# EAGLE design DCDC-BASE-X2B (EAGLE 9.6.2)
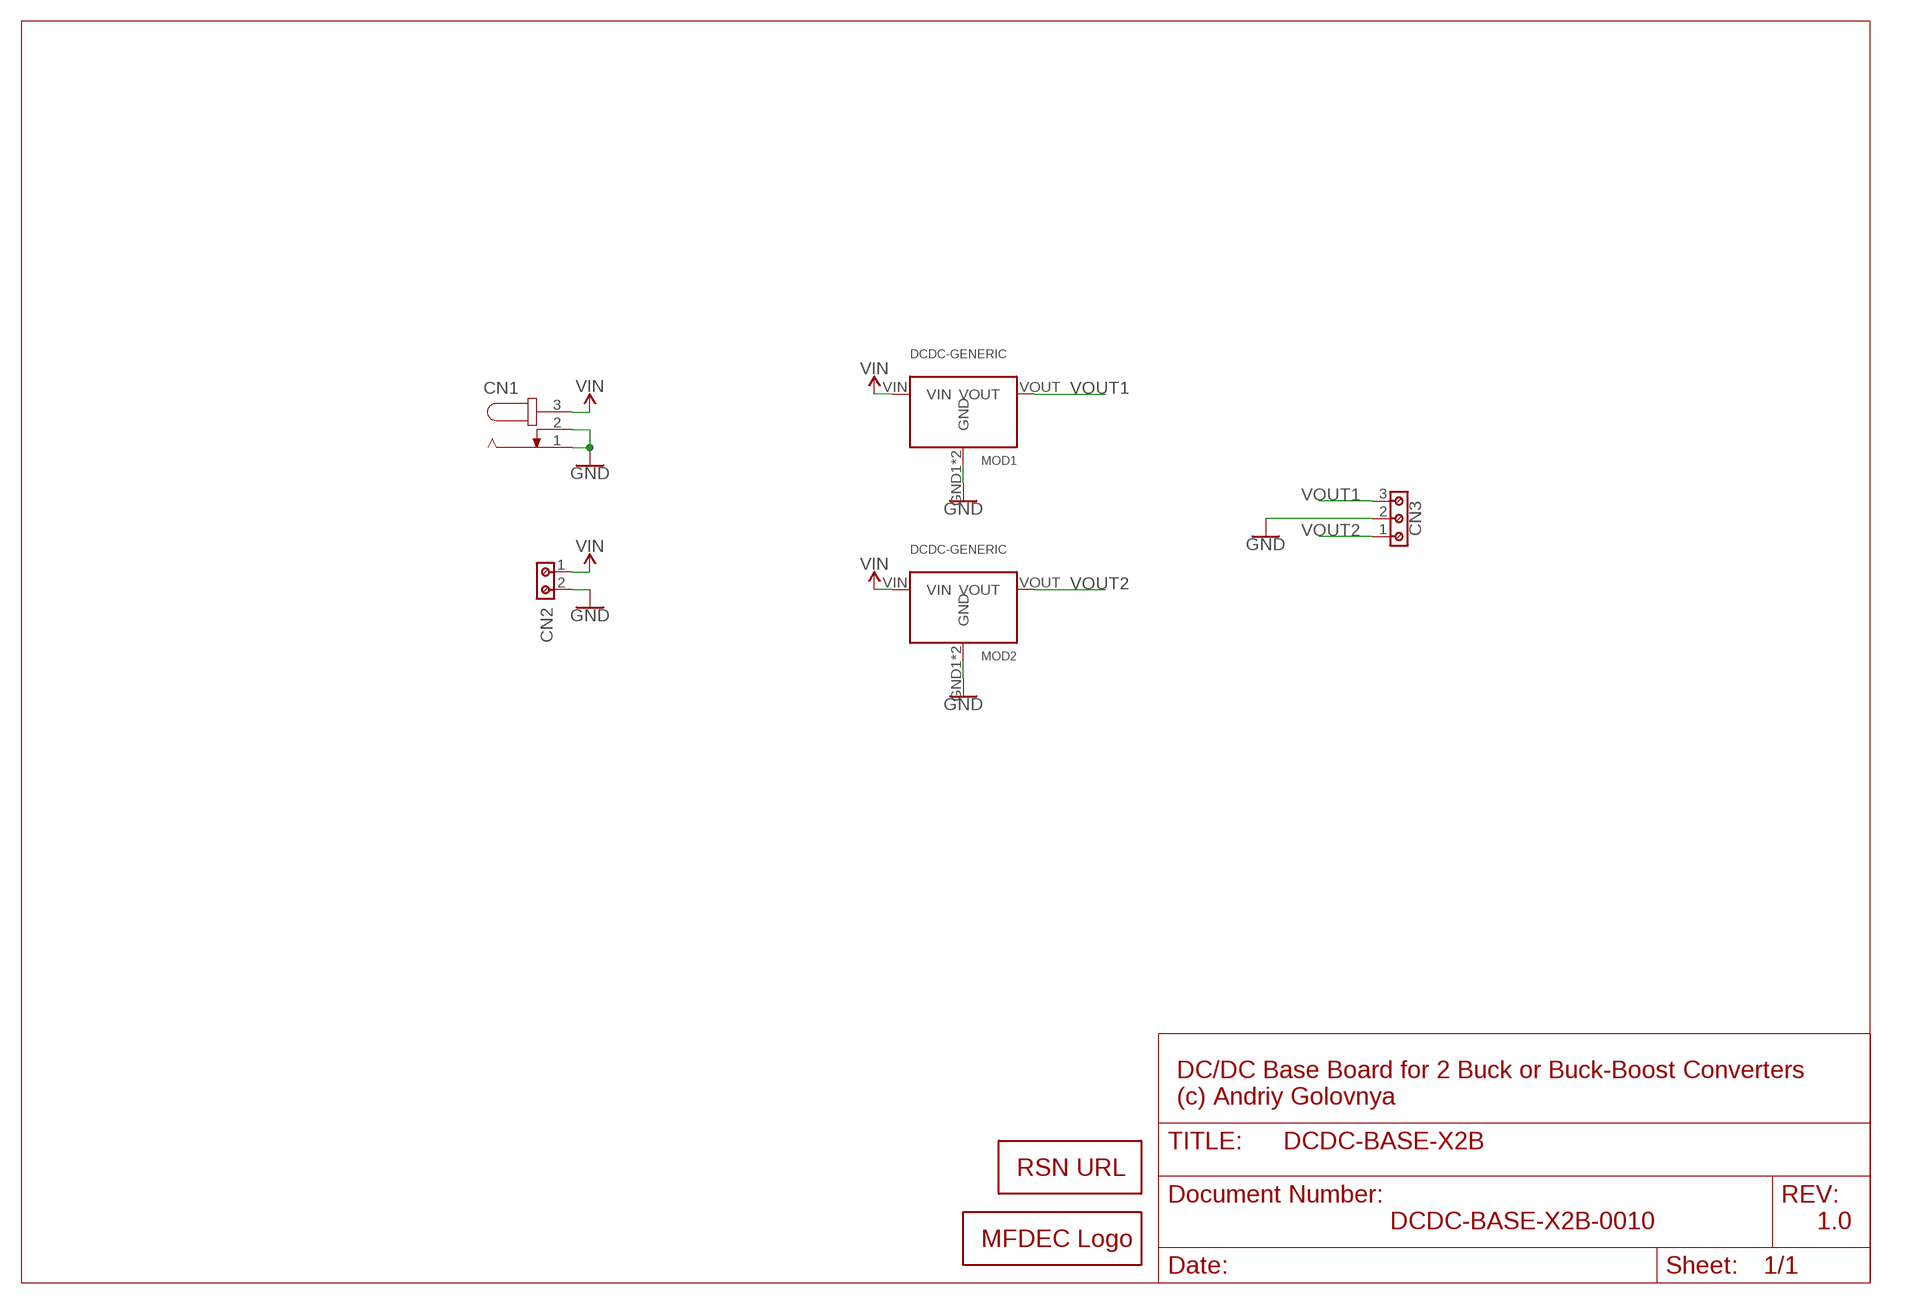
[diagram p0: schematic, sheet 1]

## Parts
CN1  JACK-PLUG1  [SPC4078]
CN2  691213510002  [691213510002]
CN3  691213510003  [691213510003]
LOGO1  RSNURL_QR_8MM  [RSNURL_QR_8MM]
LOGO2  MFDECLOGO_L_10MM  [MFDEC_L_10MM]
MOD1  DCDC-GENERIC  [DCDC-BOARD]
MOD2  DCDC-GENERIC  [DCDC-BOARD]

## Nets
GND: CN1.1 CN1.2 CN2.2 CN3.2 MOD1.GND1(GND) MOD1.GND2(GND) MOD2.GND1(GND) MOD2.GND2(GND)
VIN: CN1.3 CN2.1 MOD1.VIN MOD2.VIN
VOUT1: CN3.3 MOD1.VOUT
VOUT2: CN3.1 MOD2.VOUT

## Notes on the sheet
- DC/DC Base Board for 2 Buck or Buck-Boost Converters
  (c) Andriy Golovnya
- DCDC-BASE-X2B-0010 | 1.0

## Library data of the parts
CN1 = con-jack:JACK-PLUG: DC POWER JACK Power Jack, DC, Right Angle, Through Hole, Rated 5A at 16VDC, PC Terminals Distributor: Farnell (www.Farnell.de) Drawing: 84N1161.pdf / 84N1162.pdf Manufacturer: SPC Technology (www.spctechnology.com) Type: SPC4077 / SPC 4078; OC_FARNELL: unknown; OC_NEWARK: unknown
CN2 = Wurth_Connectors_WR-TBL Rising Cage Clamp:691213510002: WR-TBL Serie 2135 - 5.08 mm Horizontal Entry Modular w. Rising Cage Clamp KIND PROPERTIES Pitch 5.08 mm MATERIAL PROPERTIES Insulator Material PA66 Insulator Flammability Rating UL94 V-0 Contact Material Copper Alloy Contact Plating Tin over Nickel Contact Type Stamped Terminal Screw Material Steel Terminal Screw Plating Zinc Wire Guard Material Copper Alloy GENERAL INFORMATION Operating Temperature -30 up to +120 °C Compliance ROHS & Reach ELECTRICAL PROPERTIES IR UL 14 A IR VDE 14 A Working Voltage [UL] 300 V (AC) Working Voltage [VDE] 250 V (AC) Withstanding Voltage [UL] 1600 V (AC) Withstanding Voltage [VDE] 2000 V (AC) Contact Resistance 20 mΩ MECHANICAL PROPERTIES Wire Strip Length 6 Screw M3 CERTIFICATION UL Approval E150931 VDE Approval 40021366 PACKAGING PROPERTIES Packaging Box <https://www.we-online.com/catalog/media/o32805v209%20Family_WR-TBL2_Series2135.jpg> Details see: https://www.we-online.com/catalog/en/TBL_5_08_2135_HORIZONTAL_ENTRY_MODULAR_69121351000x/ Updated by Ella Wu 2019-11-26 2019(C) Wurth Elektronik; IR-UL: 14A; IR-VDE: 14A; PART-NUMBER: 691213510002; PINS: 2; PITCH: 5.08mm; TYPE: Horizontal; WIRE: 14 to 30 (AWG) 2.08 to 0.0509 (mm²); WORKING-VOLTAGE-UL: 300V (AC); WORKING-VOLTAGE-VDE: 250V (AC)
CN3 = Wurth_Connectors_WR-TBL Rising Cage Clamp:691213510003: WR-TBL Serie 2135 - 5.08 mm Horizontal Entry Modular w. Rising Cage Clamp KIND PROPERTIES Pitch 5.08 mm MATERIAL PROPERTIES Insulator Material PA66 Insulator Flammability Rating UL94 V-0 Contact Material Copper Alloy Contact Plating Tin over Nickel Contact Type Stamped Terminal Screw Material Steel Terminal Screw Plating Zinc Wire Guard Material Copper Alloy GENERAL INFORMATION Operating Temperature -30 up to +120 °C Compliance ROHS & Reach ELECTRICAL PROPERTIES IR UL 14 A IR VDE 14 A Working Voltage [UL] 300 V (AC) Working Voltage [VDE] 250 V (AC) Withstanding Voltage [UL] 1600 V (AC) Withstanding Voltage [VDE] 2000 V (AC) Contact Resistance 20 mΩ MECHANICAL PROPERTIES Wire Strip Length 6 Screw M3 CERTIFICATION UL Approval E150931 VDE Approval 40021366 PACKAGING PROPERTIES Packaging Box <https://www.we-online.com/catalog/media/o32805v209%20Family_WR-TBL2_Series2135.jpg> Details see: https://www.we-online.com/catalog/en/TBL_5_08_2135_HORIZONTAL_ENTRY_MODULAR_69121351000x/ Updated by Ella Wu 2019-11-26 2019(C) Wurth Elektronik; IR-UL: 14A; IR-VDE: 14A; PART-NUMBER: 691213510003; PINS: 3; PITCH: 5.08mm; TYPE: Horizontal; WIRE: 14 to 30 (AWG) 2.08 to 0.0509 (mm²); WORKING-VOLTAGE-UL: 300V (AC); WORKING-VOLTAGE-VDE: 250V (AC)
LOGO1 = _my_logos:RSNURL: RedScorp.Net URL
LOGO2 = _my_logos:MFDECLOGO: Midnight Fog - Digital Eye Candy LOGO
MOD1 MOD2 = DCDC:DCDC-GENERIC

## Net classes
0 default: width 0.254 mm

## Board
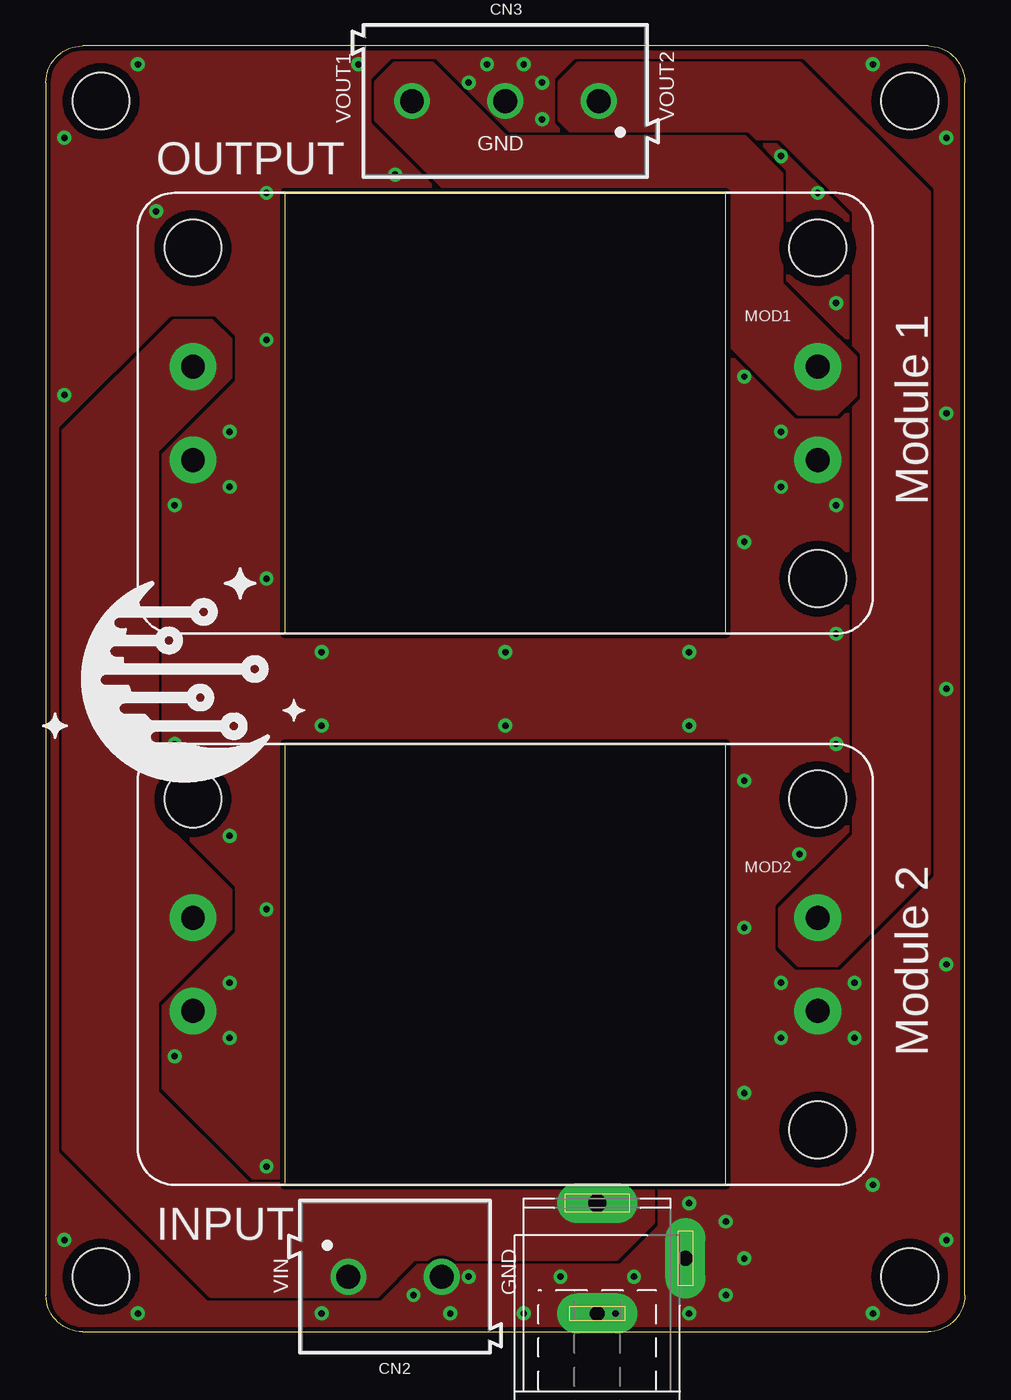
[diagram p1: board, top side]
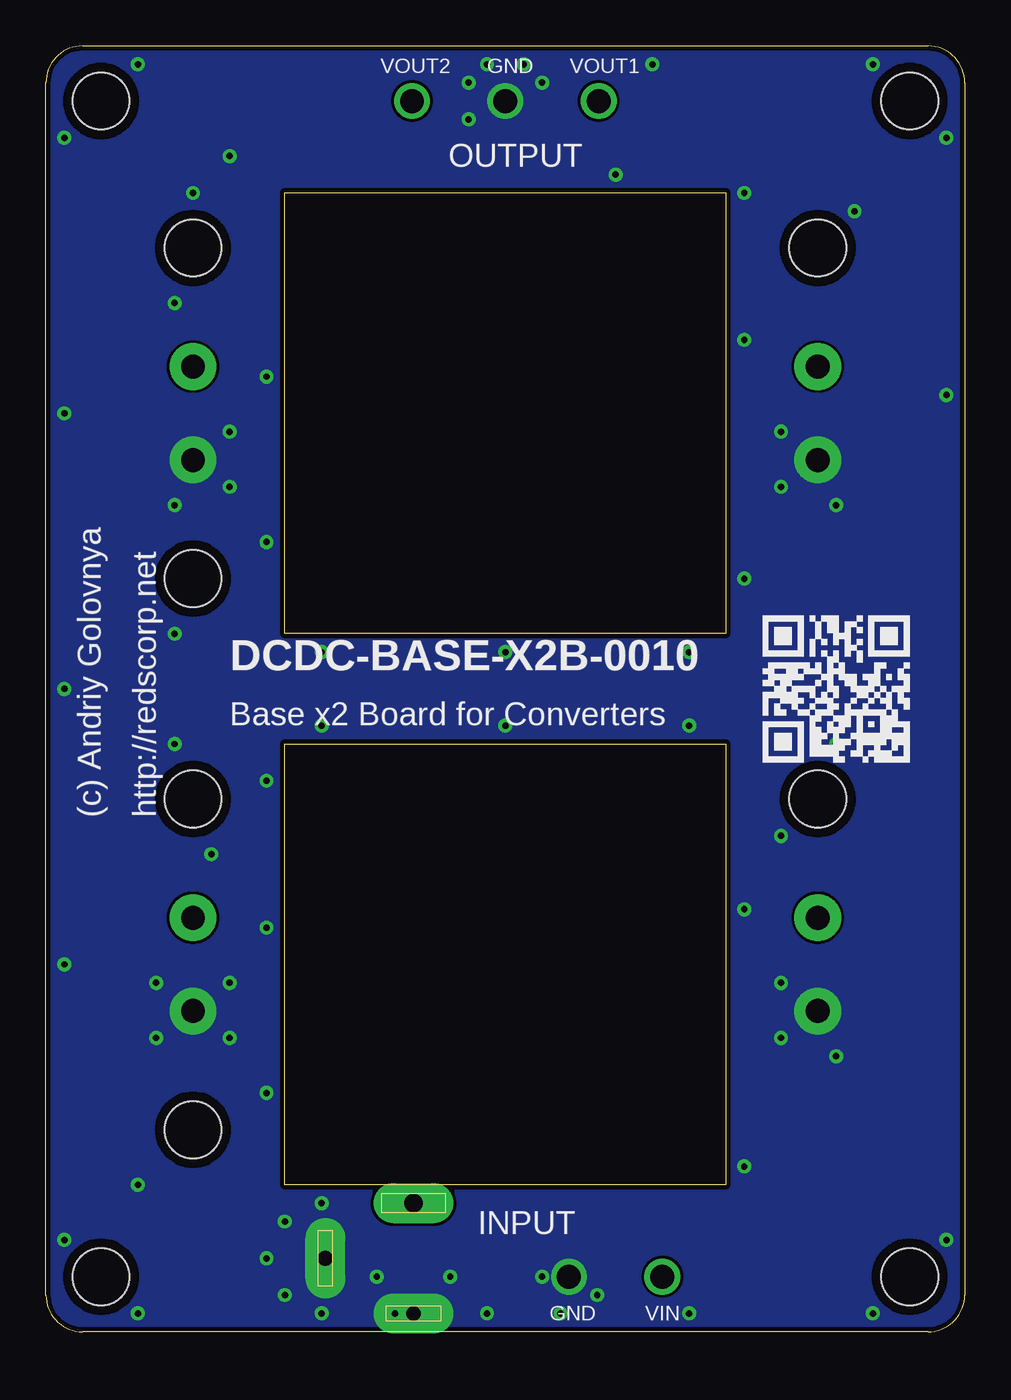
[diagram p2: board, bottom side, seen from below]

Size 50 x 70 mm. Coordinates in mm from the lower left corner, seen from the top.
Outline: 2,0 48,0 arc90 50,2 50,68 arc90 48,70 2,70 arc90 0,68 0,2 arc90 2,0
Copper layers (1*16): Top 0.035mm / dielectric 1.5mm / Bottom 0.035mm
Design rules "default *": minimum track width 6mil, minimum drill 0.35mm, track to track 6mil, track to pad 6mil, pad to pad 6mil, via to via 6mil, smd to smd 6mil, copper to edge 10mil, drill to drill 6mil, minimum pad ring 10mil, minimum via ring 8mil, stop-mask expansion 4mil, vias tented up to drill 20mil, thermal gap 10mil
Holes 3.1 mm at 3,67 47,67 47,3 3,3

### Footprints (pad centres in the part's own frame; a part is rotated, then mirrored left to right if it is on the bottom)
SPC4078 = drill 0.8 pad 2.184 long: 1 -3,0; 2 0,-4.8 | drill 1 pad 2.184 long: 3 3,0
691213510002 = drill 1.3: 1 -2.54,0; 2 2.54,0
691213510003 = drill 1.3: 1 -5.08,0; 2 0,0; 3 5.08,0
DCDC-BOARD = drill 1.3 pad 2.54: GND1 -17,-2.54; GND2 17,-2.54; VIN -17,2.54; VOUT 17,2.54 | hole 3.1: 17,-9; 17,9; -17,9

### Placement (x,y rotation side)
CN1  30,4 90 top
CN2  19,3 0 top
CN3  25,67 180 top
LOGO1  11,31 0 bottom
LOGO2  -1,29 0 top
MOD1  25,50 0 top
MOD2  25,20 0 top

### Tracks (layer width: path | path; a pad name or v marks a point on that pad's centre or on a via)
GND  (via drill 0.35)
  other vias: 7,32 7,45 10,19 10,16 40,19 44,19 44,16 40,16 40,49 40,46 43,45 45,69 49,65 5,69 1,65 5,1 1,5 45,1 49,5 35,37 15,37 17,69 15,1 31,1 12,9 1,51 49,50 49,20 49,35 10,49 10,46 7,15 24,69 26,69 23,68 27,68 27,66 42,62 41,26 43,32 25,37 25,33 15,33 35,33 12,41 10,27 6,61 43,38 20,2 23,3 22,1 32,3 35,7 35,1 28,3 19,63 12,54 12,62 38,22 38,13 40,64 43,56 38,52 38,43 38,30 45,8 12,23 37,6 37,2 38,4 26,1
  pour Top (rank 3, no thermals): 50,0 -5,0 -5,70 50,70
  pour Bottom (rank 3, no thermals): 0,70 0,0 55,0 55,70
  cutout Top: 47,1 arc-180 47,5 arc-180
  cutout Top: 47,65 arc-180 47,69 arc-180
  cutout Top: 3,65 arc-180 3,69 arc-180
  cutout Bottom: 3,65 arc-180 3,69 arc-180
  cutout Bottom: 47,65 arc-180 47,69 arc-180
  cutout Bottom: 47,1 arc-180 47,5 arc-180
GND1
  cutout Top: 8,57 arc-180 8,61 arc-180
  cutout Bottom: 8,57 arc-180 8,61 arc-180
GND2
  cutout Top: 42,57 arc-180 42,61 arc-180
  cutout Bottom: 42,57 arc-180 42,61 arc-180
GND3
  cutout Top: 47,1 arc-180 47,5 arc-180
  cutout Bottom: 47,1 arc-180 47,5 arc-180
GND4
  cutout Top: 3,1 arc-180 3,5 arc-180
  cutout Bottom: 3,1 arc-180 3,5 arc-180
GND5
  cutout Top: 3,1 arc-180 3,5 arc-180
  cutout Bottom: 3,1 arc-180 3,5 arc-180
GND6
  cutout Top: 42,39 arc-180 42,43 arc-180
  cutout Bottom: 42,39 arc-180 42,43 arc-180
GND7
  cutout Top: 42,27 arc-180 42,31 arc-180
  cutout Bottom: 42,27 arc-180 42,31 arc-180
GND8
  cutout Top: 8,27 arc-180 8,31 arc-180
  cutout Bottom: 8,27 arc-180 8,31 arc-180
GND9
  cutout Top: 42,9 arc-180 42,13 arc-180
  cutout Bottom: 42,9 arc-180 42,13 arc-180
VIN
  pour Top (no thermals): 33,8 33,6 31,4 20,4 18,2 9,2 1,10 1,49 7,55 9,55 10,54 10,52 6,48 6,28 10,24 10,22 6,18 6,13 11,8
VOUT1
  pour Top (no thermals): 18,68 18,66 22,62 37,62 37,56 37,54 41,50 43,50 44,51 44,53 42,55 40,57 40,61 40,63 38,65 25,65 21,69 19,69
VOUT2
  pour Top (rank 2, no thermals): 28,68 28,66 29,65 40,65 44,61 44,27 40,23 40,21 41,20 43,20 48,25 48,62 41,69 29,69

### Text on the board
tPlace: VOUT1 | VOUT2 | GND | OUTPUT | Module 1 | Module 2 | INPUT | VIN | GND
bPlace: VOUT1 | GND | VOUT2 | OUTPUT | DCDC-BASE-X2B-0010 | Base x2 Board for Converters | http://redscorp.net | (c) Andriy Golovnya | INPUT | VIN | GND